# Altium schematic sheet Main.SchDoc
size A4; Date: 07.06.2021; Author: Mateusz Mróz; CompanyName: AGH; DocumentNumber: 1; SheetNumber: 1; SheetTotal: 6
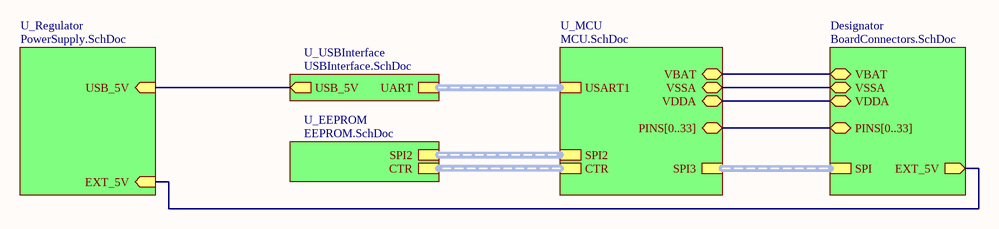
[diagram p0: Main.SchDoc]

## Sub-sheets
Designator = BoardConnectors.SchDoc: PINS[0..33] (bidir), VBAT (bidir), VDDA (bidir), VSSA (bidir), SPI (harness SPI), EXT_5V (out)
U_EEPROM = EEPROM.SchDoc: SPI2 (harness SPI), CTR (harness CTR)
U_MCU = MCU.SchDoc: CTR (harness CTR), PINS[0..33] (bidir), VDDA (bidir), VBAT (bidir), VSSA (bidir), USART1 (harness USART), SPI2 (harness SPI), SPI3 (harness SPI)
U_Regulator = PowerSupply.SchDoc: EXT_5V (in), USB_5V (in)
U_USBInterface = USBInterface.SchDoc: UART (harness UART), USB_5V (out)

## Nets
(unnamed): sheet U_MCU/VDDA, sheet Designator/VDDA
(unnamed): sheet U_MCU/VBAT, sheet Designator/VBAT
(unnamed): sheet U_MCU/VSSA, sheet Designator/VSSA
(unnamed): sheet U_USBInterface/USB_5V, sheet U_Regulator/USB_5V
(unnamed): sheet U_Regulator/EXT_5V, sheet Designator/EXT_5V

## Buses and harness runs
bus sheet Designator/PINS[0..33] = sheet U_MCU/PINS[0..33]
harness sheet Designator/SPI = sheet U_MCU/SPI3
harness sheet U_EEPROM/CTR = sheet U_MCU/CTR
harness sheet U_EEPROM/SPI2 = sheet U_MCU/SPI2
harness sheet U_MCU/USART1 = sheet U_USBInterface/UART

## Notes on the sheet
- University name:
- Degree course:
- 3th year electronics
- Date:
- Author:
- Student Index:
- Course:
- Checked by:
- PUE
- dr hab. inż. Cezary Worek, prof. AGH
- 305093
- Project name:
- Document name:
- Variant name:
- Sheet/all:
- /
- Version number: